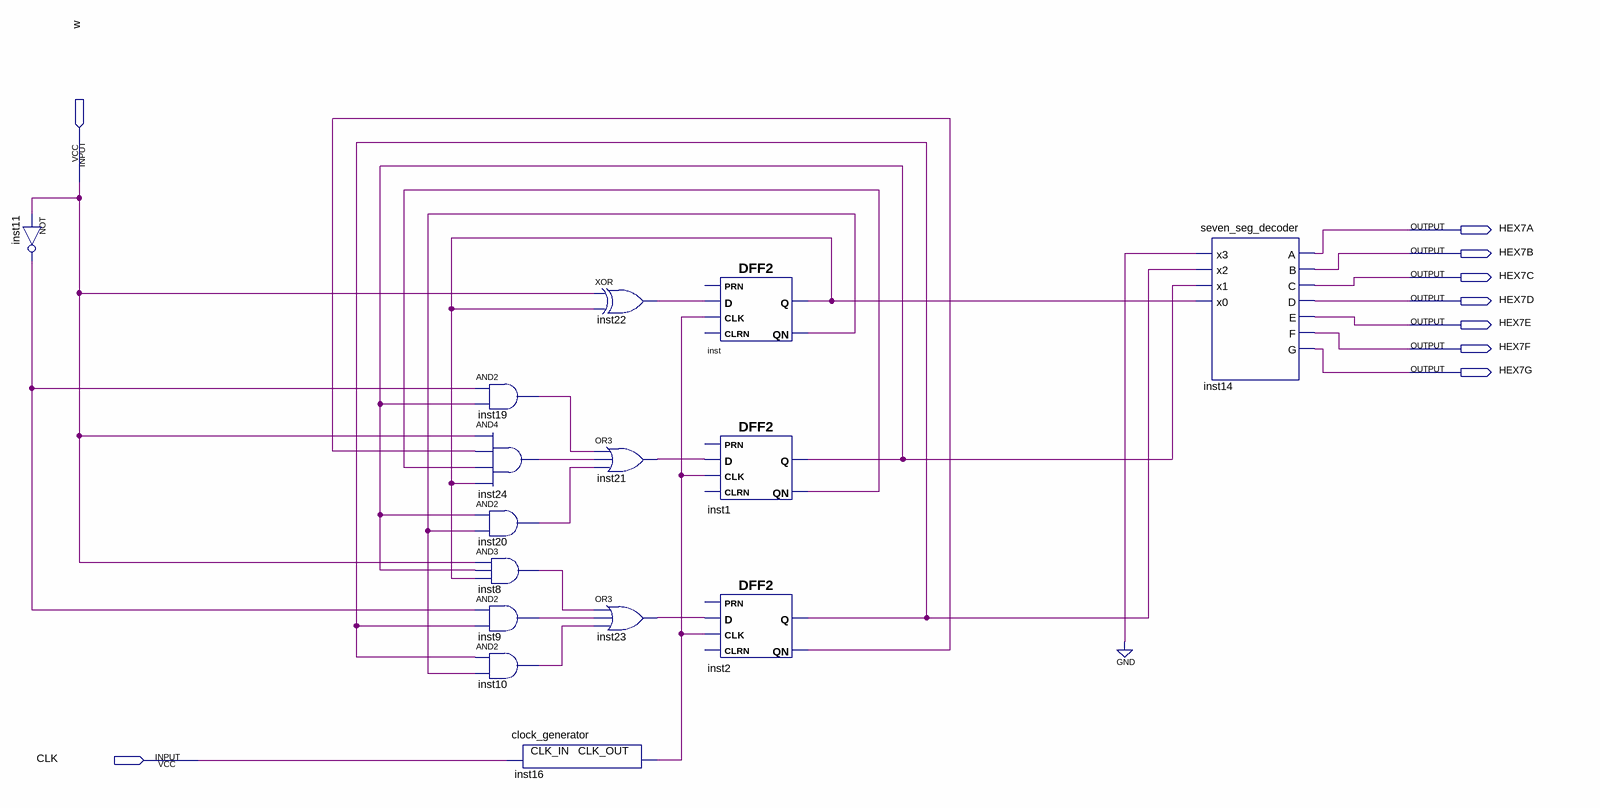
[diagram p0: schematic sheet]
// Quartus schematic lab11step1.bdf as structural Verilog: 15 symbols, 9 pins
module lab11step1 (
  input  w,
  input  CLK,
  output HEX7A,
  output HEX7B,
  output HEX7C,
  output HEX7D,
  output HEX7E,
  output HEX7F,
  output HEX7G
);

  wire inst1_q, inst1_qn, inst2_q, inst2_qn, inst8_out, inst9_out, inst10_out, inst11_out, inst16_clk_out,
       inst19_out, inst20_out, inst21_out, inst22_out, inst23_out, inst24_out, inst_q, inst_qn;

  not inst11 (inst11_out, w);
  and inst19 (inst19_out, inst11_out, inst1_q);
  and inst24 (inst24_out, w, inst2_qn, inst1_qn, inst_q);
  and inst20 (inst20_out, inst1_q, inst_qn);
  and inst8 (inst8_out, w, inst1_q, inst_q);
  and inst9 (inst9_out, inst11_out, inst2_q);
  and inst10 (inst10_out, inst2_q, inst_qn);
  clock_generator inst16 (.CLK_IN(CLK), .CLK_OUT(inst16_clk_out));
  xor inst22 (inst22_out, w, inst_q);
  or inst21 (inst21_out, inst19_out, inst24_out, inst20_out);
  or inst23 (inst23_out, inst8_out, inst9_out, inst10_out);
  DFF2 inst (.CLK(inst16_clk_out), .D(inst22_out), .Q(inst_q), .QN(inst_qn));  // open: PRN, CLRN
  DFF2 inst1 (.CLK(inst16_clk_out), .D(inst21_out), .Q(inst1_q), .QN(inst1_qn));  // open: PRN, CLRN
  DFF2 inst2 (.CLK(inst16_clk_out), .D(inst23_out), .Q(inst2_q), .QN(inst2_qn));  // open: PRN, CLRN
  seven_seg_decoder inst14 (
    .x3(1'b0), .x2(inst2_q), .x1(inst1_q), .x0(inst_q), .A(HEX7A), .B(HEX7B), .C(HEX7C), .D(HEX7D),
    .E(HEX7E), .F(HEX7F), .G(HEX7G));
endmodule
